# EAGLE design KammsensorV1 (EAGLE 7.7.0)
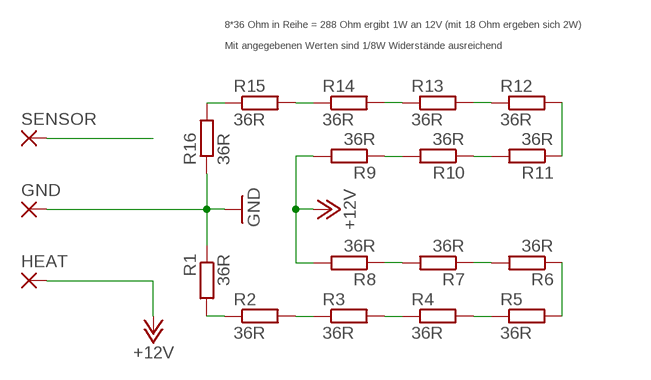
[diagram p0: schematic, sheet 1]

## Parts
GND  WIREPADSMD5-1,8  [5-1,8]
HEAT  WIREPADSMD5-1,8  [5-1,8]
R1  36R  R-EU_M1206  [M1206]
R2  36R  R-EU_M1206  [M1206]
R3  36R  R-EU_M1206  [M1206]
R4  36R  R-EU_M1206  [M1206]
R5  36R  R-EU_M1206  [M1206]
R6  36R  R-EU_M1206  [M1206]
R7  36R  R-EU_M1206  [M1206]
R8  36R  R-EU_M1206  [M1206]
R9  36R  R-EU_M1206  [M1206]
R10  36R  R-EU_M1206  [M1206]
R11  36R  R-EU_M1206  [M1206]
R12  36R  R-EU_M1206  [M1206]
R13  36R  R-EU_M1206  [M1206]
R14  36R  R-EU_M1206  [M1206]
R15  36R  R-EU_M1206  [M1206]
R16  36R  R-EU_M1206  [M1206]
SENSOR  WIREPADSMD5-1,8  [5-1,8]

## Nets
+12V: HEAT.1(P) R8.2 R9.2
GND: GND.1(P) R1.1 R16.1
N$1: R3.2 R4.1
N$2: R2.2 R3.1
N$3: R14.1 R15.2
N$4: R4.2 R5.1
N$5: R5.2 R6.1
N$6: R6.2 R7.1
N$7: R1.2 R2.1
N$8: R7.2 R8.1
N$9: R9.1 R10.2
N$11: R10.1 R11.2
N$12: R11.1 R12.2
N$13: R12.1 R13.2
N$14: R13.1 R14.2
N$15: R15.1 R16.2
SENSOR: SENSOR.1(P)

## Notes on the sheet
- 8*36 Ohm in Reihe = 288 Ohm ergibt 1W an 12V (mit 18 Ohm ergeben sich 2W)
  
  Mit angegebenen Werten sind 1/8W Widerstände ausreichend

## Library data of the parts
GND HEAT SENSOR = wirepad:WIREPAD: Wire PAD connect wire on PCB
R1-R16 = rcl:R-EU_: RESISTOR, European symbol

## Net classes
0 default: width 0.305 mm
1 PWR: width 0.61 mm

## Board
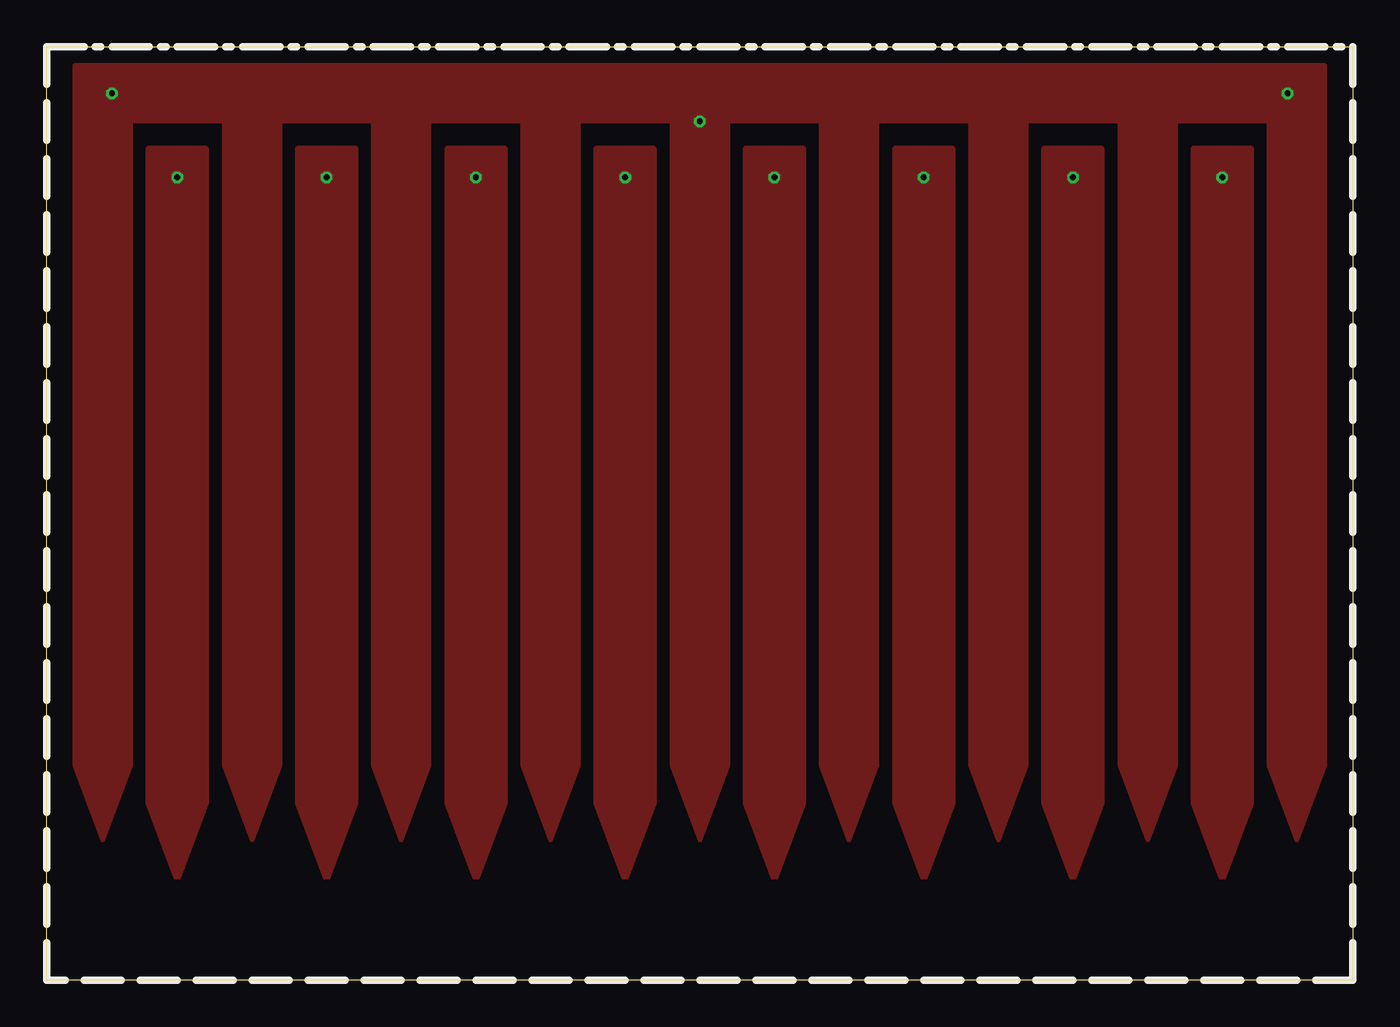
[diagram p1: board, top side]
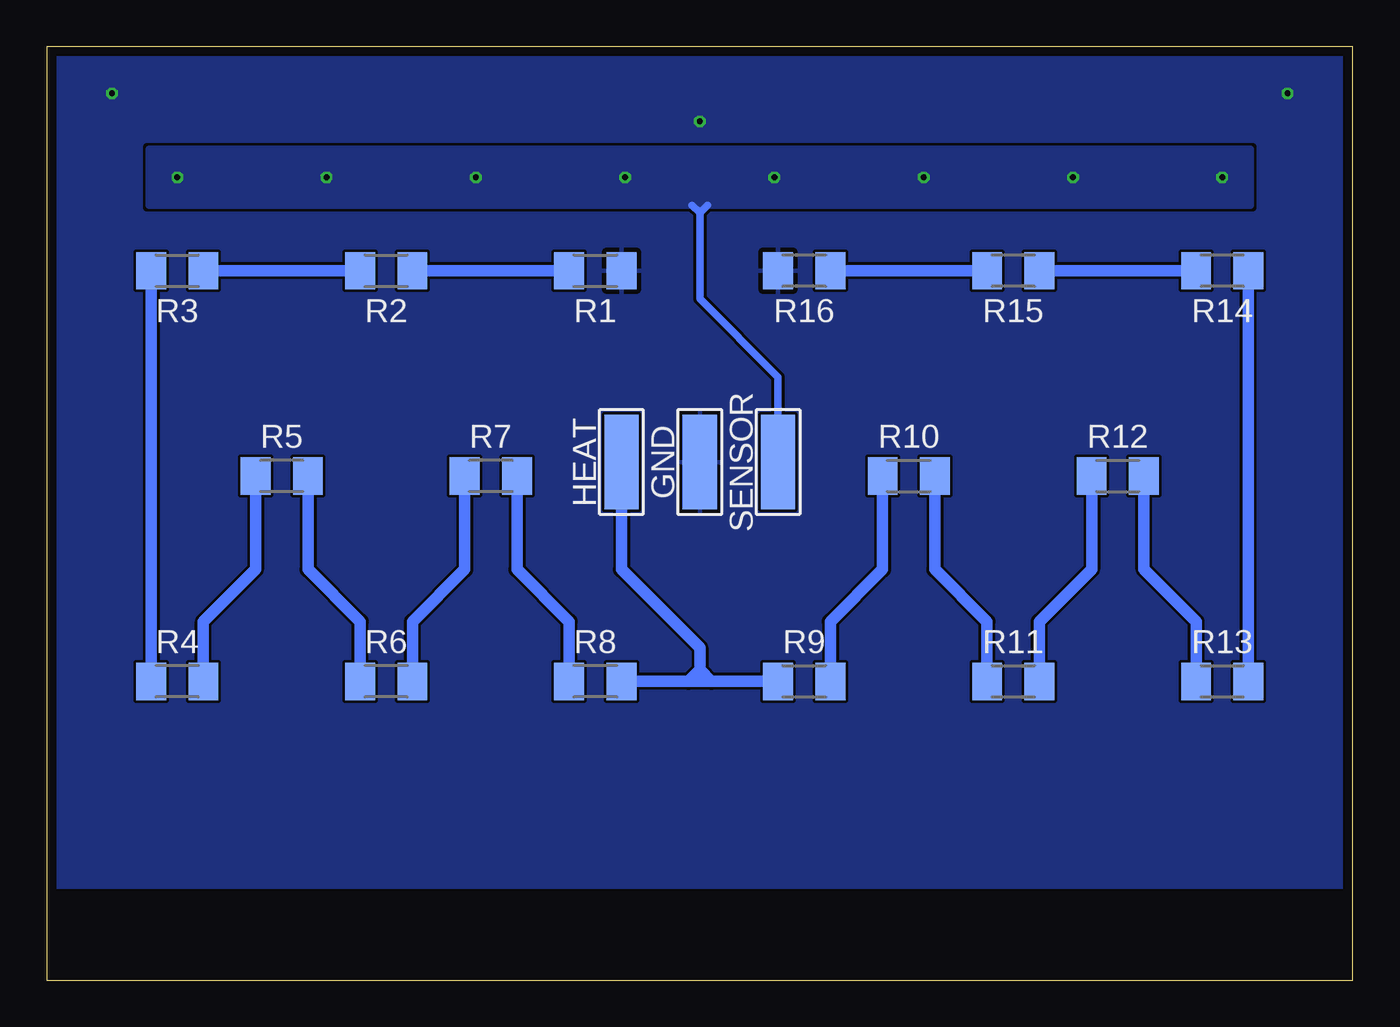
[diagram p2: board, bottom side, seen from below]

Size 70 x 50 mm. Coordinates in mm from the lower left corner, seen from the top.
Outline: 0,0 0,50 70,50 70,0 0,0
Copper layers (1*16): Top 0.035mm / dielectric 1.6mm / Bottom 0.035mm
Design rules "Elecrow": minimum track width 6mil, minimum drill 12mil, track to track 6mil, track to pad 6mil, pad to pad 6mil, via to via 8mil, smd to smd 0mil, copper to edge 20mil, drill to drill 10mil, minimum pad ring 6mil, minimum via ring 6mil, stop-mask expansion 0mil, vias tented up to drill 100mil, thermal gap 10mil

### Footprints (pad centres in the part's own frame; a part is rotated, then mirrored left to right if it is on the bottom)
5-1,8 = smd 1.829 x 5.08: 1 0,0
M1206 = smd 1.6 x 2: 1 -1.4,0; 2 1.4,0

### Placement (x,y rotation side)
GND  35,27.75 0 bottom
HEAT  39.2,27.75 0 bottom
R1  40.6,38 180 bottom
R2  51.8,38 180 bottom
R3  63,38 180 bottom
R4  63,16 0 bottom
R5  57.4,27 0 bottom
R6  51.8,16 0 bottom
R7  46.2,27 0 bottom
R8  40.6,16 0 bottom
R9  29.4,16 180 bottom
R10  23.8,27 180 bottom
R11  18.2,16 180 bottom
R12  12.6,27 180 bottom
R13  7,16 180 bottom
R14  7,38 0 bottom
R15  18.2,38 0 bottom
R16  29.4,38 0 bottom
SENSOR  30.8,27.75 0 bottom

### Tracks (layer width: path | path; a pad name or v marks a point on that pad's centre or on a via)
+12V
  Bottom 0.61: HEAT.1 39.2,22 35,17.8 35,16.61 | R9.2 34.39,16 | 34.39,16 35.61,16 | 35.61,16 R8.2 | 35,16.61 35.61,16 | 35,16.61 34.39,16
GND  (via drill 0.3)
  other vias: 3.5,47.5 66.5,47.5 35,46
  pour Top (rank 5): 3,7.5 1.5,11.5 1.5,49 68.5,49 68.5,11.5 67,7.5 65.5,11.5 65.5,46 60.5,46 60.5,11.5 59,7.5 57.5,11.5 57.5,46 52.5,46 52.5,11.5 51,7.5 49.5,11.5 49.5,46 44.5,46 44.5,11.5 43,7.5 41.5,11.5 41.5,46 36.5,46 36.5,11.5 35,7.5 33.5,11.5 33.5,46 28.5,46 28.5,11.5 27,7.5 25.5,11.5 25.5,46 20.5,46 20.5,11.5 19,7.5 17.5,11.5 17.5,46 12.5,46 12.5,11.5 11,7.5 9.5,11.5 9.5,46 4.5,46 4.5,11.5
  pour Bottom (rank 5): 0,50 70,50 70,5 0,5
N$1
  Bottom 0.61: R3.2 R4.1
N$2
  Bottom 0.61: R2.2 R3.1
N$3
  Bottom 0.61: R14.1 R15.2
N$4
  Bottom 0.61: R5.1 58.8,22 61.6,19.2 R4.2
N$5
  Bottom 0.61: R5.2 56,22 53.2,19.2 R6.1
N$6
  Bottom 0.61: R7.1 47.6,22 50.4,19.2 R6.2
N$7
  Bottom 0.61: R1.2 R2.1
N$8
  Bottom 0.61: R7.2 44.8,22 42,19.2 R8.1
N$9
  Bottom 0.61: R10.2 25.2,22 28,19.2 R9.1
N$11
  Bottom 0.61: R10.1 22.4,22 19.6,19.2 R11.2
N$12
  Bottom 0.61: R12.2 14,22 16.8,19.2 R11.1
N$13
  Bottom 0.61: R12.1 11.2,22 8.4,19.2 R13.2
N$14
  Bottom 0.61: R13.1 R14.2
N$15
  Bottom 0.61: R15.1 R16.2
SENSOR  (via drill 0.3)
  Bottom 0.406: 35,41.09 34.59,41.5 | 35,41.09 35,36.5 30.8,32.3 SENSOR.1 | 35,41.09 35.41,41.5
  other vias: 7,43 15,43 23,43 31,43 39,43 47,43 55,43 63,43
  pour Top: 5.5,44.5 8.5,44.5 8.5,9.5 7,5.5 5.5,9.5
  pour Top: 13.5,44.5 16.5,44.5 16.5,9.5 15,5.5 13.5,9.5
  pour Top: 21.5,44.5 24.5,44.5 24.5,9.5 23,5.5 21.5,9.5
  pour Top: 29.5,44.5 32.5,44.5 32.5,9.5 31,5.5 29.5,9.5
  pour Top: 37.5,44.5 40.5,44.5 40.5,9.5 39,5.5 37.5,9.5
  pour Top: 45.5,44.5 48.5,44.5 48.5,9.5 47,5.5 45.5,9.5
  pour Top: 53.5,44.5 56.5,44.5 56.5,9.5 55,5.5 53.5,9.5
  pour Top: 61.5,44.5 64.5,44.5 64.5,9.5 63,5.5 61.5,9.5
  pour Bottom (isolate 0.254): 5.5,44.5 64.5,44.5 64.5,41.5 5.5,41.5